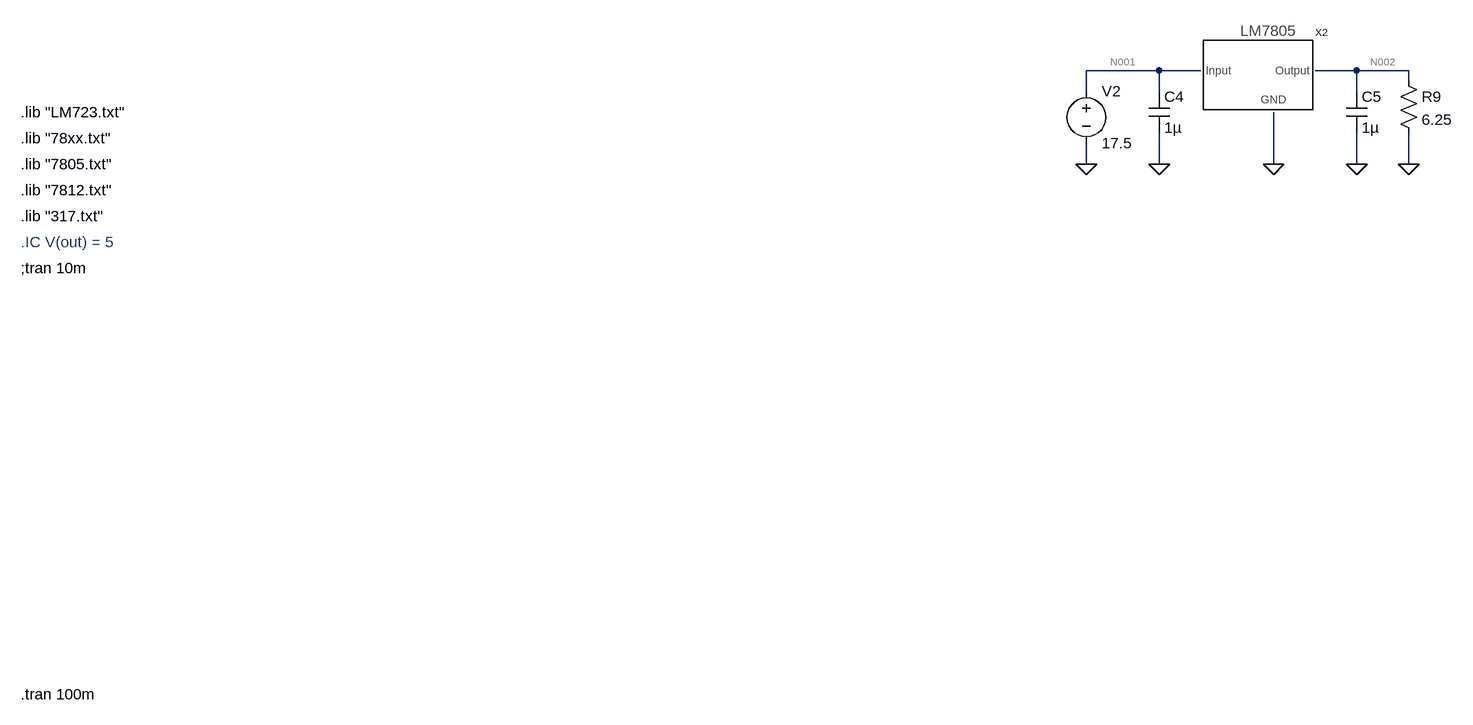
[diagram p0: schematic Draft3.asc]
Draft3.asc, the LTspice schematic file:
Version 4
SHEET 1 2612 804
WIRE 1280 -192 1168 -192
WIRE 1344 -192 1280 -192
WIRE 1584 -192 1520 -192
WIRE 1664 -192 1584 -192
WIRE 1664 -176 1664 -192
WIRE 1168 -160 1168 -192
WIRE 1280 -160 1280 -192
WIRE 1584 -160 1584 -192
WIRE 1168 -48 1168 -80
WIRE 1280 -48 1280 -96
WIRE 1456 -48 1456 -128
WIRE 1584 -48 1584 -96
WIRE 1664 -48 1664 -96
FLAG 1168 -48 0
FLAG 1280 -48 0
FLAG 1584 -48 0
FLAG 1664 -48 0
FLAG 1456 -48 0
SYMBOL cap 1264 -160 R0
SYMATTR InstName C4
SYMATTR Value 1µ
SYMBOL cap 1568 -160 R0
SYMATTR InstName C5
SYMATTR Value 1µ
SYMBOL voltage 1168 -176 R0
WINDOW 123 0 0 Left 0
WINDOW 39 0 0 Left 0
SYMATTR InstName V2
SYMATTR Value 17.5
SYMBOL LM7805 1424 -224 R0
SYMATTR InstName X2
SYMATTR Prefix X
SYMATTR Value LM7805C
SYMBOL res 1648 -192 R0
SYMATTR InstName R9
SYMATTR Value 6.25
TEXT -472 -128 Left 2 !.lib "LM723.txt"
TEXT -472 112 Left 2 !;tran 10m
TEXT -472 -48 Left 2 !.lib "7805.txt"
TEXT -472 -8 Left 2 !.lib "7812.txt"
TEXT -472 -88 Left 2 !.lib "78xx.txt"
TEXT -472 32 Left 2 !.lib "317.txt"
TEXT -472 72 Left 2 ;.IC V(out) = 5
TEXT -472 768 Left 2 !.tran 100m

The netlist it stands for:
* Draft3.asc
C4 N001 0 1µ
C5 N002 0 1µ
V2 N001 0 17.5
XX2 N001 0 N002 LM7805 params: LM7805C  ; pins Input GND Output
R9 N002 0 6.25
.lib "LM723.txt"
;tran 10m
.lib "7805.txt"
.lib "7812.txt"
.lib "78xx.txt"
.lib "317.txt"
* .IC V(out) = 5
.tran 100m
.backanno
.end

* Results of the author's LTspice run, read from the files saved beside the schematic
* Operating Point, zero values left out:
*   V(n001) = 17.5 V
*   V(n002) = 4.991 V
*   I(R9) = 798.5 mA
*   I(V2) = -803.7 mA
*   Ix(x2:INPUT) = 803.7 mA
*   Ix(x2:GROUND) = -5.149 mA
*   Ix(x2:OUTPUT) = -798.5 mA